# Altium schematic sheet TEC_CTRL.SchDoc
size OrCAD B; SheetNumber: 5; SheetTotal: 11
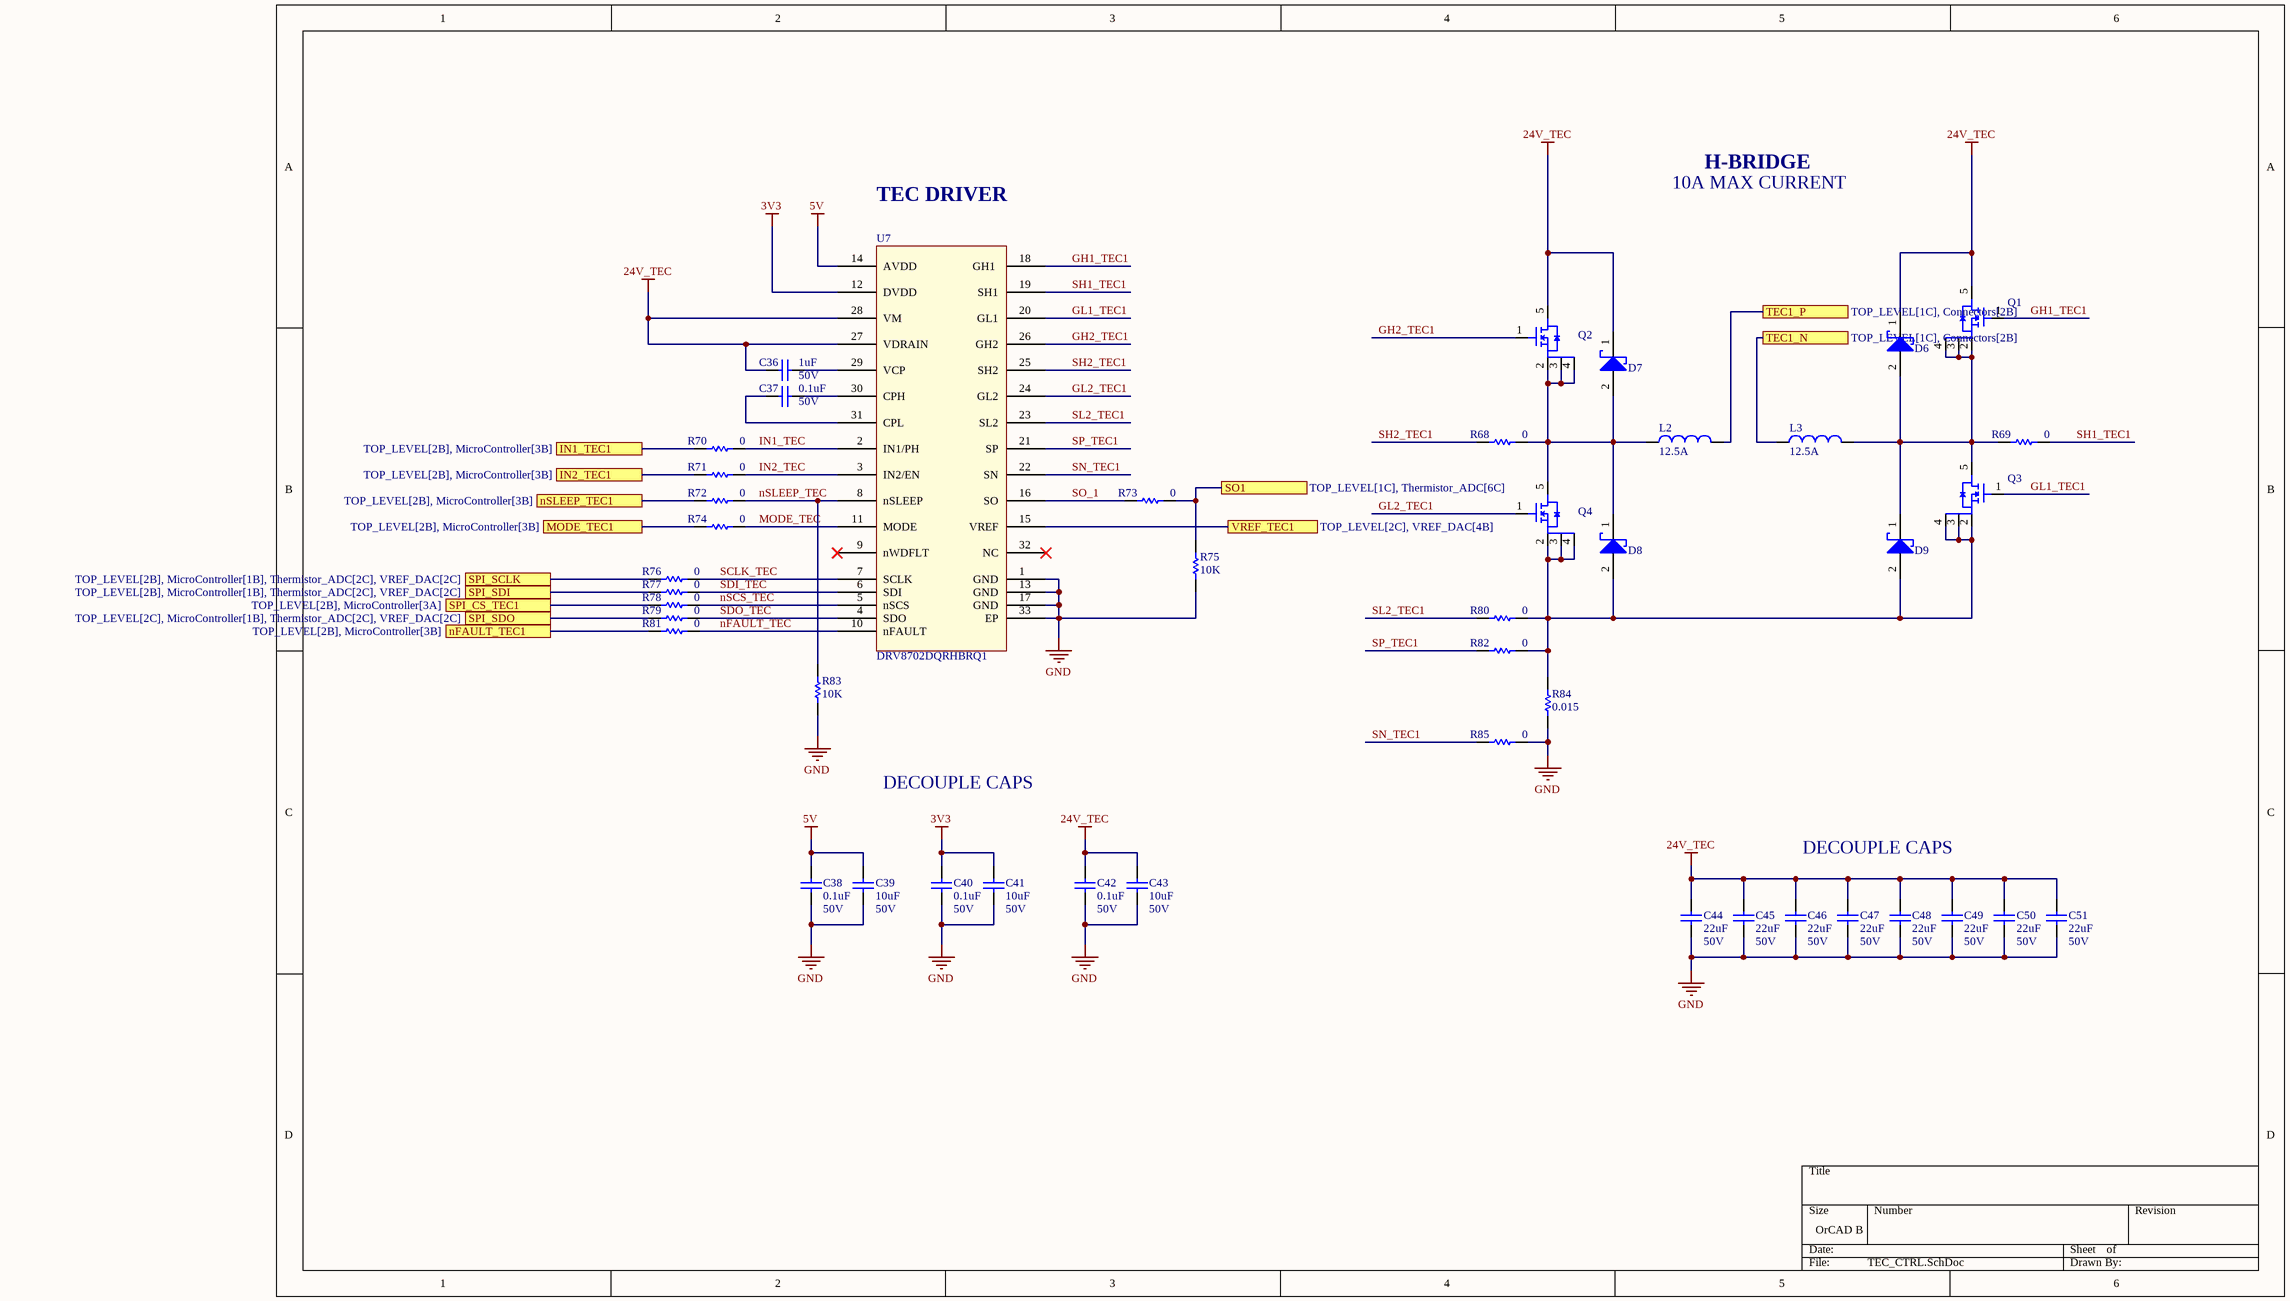
[diagram p0: TEC_CTRL.SchDoc]

## Parts
C36  value 1uF  Rating: 50V  [DEFAULT_CAPACITOR_0805]  (hidden comment: CL21B105KBFNNNE)
C37  value 0.1uF  Rating: 50V  [DEFAULT_CAPACITOR_0805]  (hidden comment: KGM21NR71H104KT)
C38  value 0.1uF  Rating: 50V  [DEFAULT_CAPACITOR_0805]  (hidden comment: KGM21NR71H104KT)
C39  value 10uF  Rating: 50V  [DEFAULT_CAPACITOR_0805]  (hidden comment: GRM21BR61H106KE43L)
C40  value 0.1uF  Rating: 50V  [DEFAULT_CAPACITOR_0805]  (hidden comment: KGM21NR71H104KT)
C41  value 10uF  Rating: 50V  [DEFAULT_CAPACITOR_0805]  (hidden comment: GRM21BR61H106KE43L)
C42  value 0.1uF  Rating: 50V  [DEFAULT_CAPACITOR_0805]  (hidden comment: KGM21NR71H104KT)
C43  value 10uF  Rating: 50V  [DEFAULT_CAPACITOR_0805]  (hidden comment: GRM21BR61H106KE43L)
C44  value 22uF  Rating: 50V  [DEFAULT_CAPACITOR_2220]  (hidden comment: C5750X7R1H226M250KB)
C45  value 22uF  Rating: 50V  [DEFAULT_CAPACITOR_2220]  (hidden comment: C5750X7R1H226M250KB)
C46  value 22uF  Rating: 50V  [DEFAULT_CAPACITOR_2220]  (hidden comment: C5750X7R1H226M250KB)
C47  value 22uF  Rating: 50V  [DEFAULT_CAPACITOR_2220]  (hidden comment: C5750X7R1H226M250KB)
C48  value 22uF  Rating: 50V  [DEFAULT_CAPACITOR_2220]  (hidden comment: C5750X7R1H226M250KB)
C49  value 22uF  Rating: 50V  [DEFAULT_CAPACITOR_2220]  (hidden comment: C5750X7R1H226M250KB)
C50  value 22uF  Rating: 50V  [DEFAULT_CAPACITOR_2220]  (hidden comment: C5750X7R1H226M250KB)
C51  value 22uF  Rating: 50V  [DEFAULT_CAPACITOR_2220]  (hidden comment: C5750X7R1H226M250KB)
D6  B2100Q-13-F  [B2100Q-13-F-SMB]  (value not drawn)
D7  B2100Q-13-F  [B2100Q-13-F-SMB]  (value not drawn)
D8  B2100Q-13-F  [B2100Q-13-F-SMB]  (value not drawn)
D9  B2100Q-13-F  [B2100Q-13-F-SMB]  (value not drawn)
L2  Rating: 12.5A  [BOURNS-SRP1770TA]  (hidden comment: SRP1770TA-150M)
L3  Rating: 12.5A  [BOURNS-SRP1770TA]  (hidden comment: SRP1770TA-150M)
Q1  BUK7S2R0-40HJ  [BUK7S2R0-40HJ-SOT1235]  (value not drawn)
Q2  BUK7S2R0-40HJ  [BUK7S2R0-40HJ-SOT1235]  (value not drawn)
Q3  BUK7S2R0-40HJ  [BUK7S2R0-40HJ-SOT1235]  (value not drawn)
Q4  BUK7S2R0-40HJ  [BUK7S2R0-40HJ-SOT1235]  (value not drawn)
R68  value 0  [DEFAULT_RESISTOR_0805]  (hidden comment: RC0805JR-070RL)
R69  value 0  [DEFAULT_RESISTOR_0805]  (hidden comment: RC0805JR-070RL)
R70  value 0  [DEFAULT_RESISTOR_0805]  (hidden comment: RC0805JR-070RL)
R71  value 0  [DEFAULT_RESISTOR_0805]  (hidden comment: RC0805JR-070RL)
R72  value 0  [DEFAULT_RESISTOR_0805]  (hidden comment: RC0805JR-070RL)
R73  value 0  [DEFAULT_RESISTOR_0805]  (hidden comment: RC0805JR-070RL)
R74  value 0  [DEFAULT_RESISTOR_0805]  (hidden comment: RC0805JR-070RL)
R75  value 10K  [DEFAULT_RESISTOR_0805]  (hidden comment: CRCW080510K0FKEA)
R76  value 0  [DEFAULT_RESISTOR_0805]  (hidden comment: RC0805JR-070RL)
R77  value 0  [DEFAULT_RESISTOR_0805]  (hidden comment: RC0805JR-070RL)
R78  value 0  [DEFAULT_RESISTOR_0805]  (hidden comment: RC0805JR-070RL)
R79  value 0  [DEFAULT_RESISTOR_0805]  (hidden comment: RC0805JR-070RL)
R80  value 0  [DEFAULT_RESISTOR_0805]  (hidden comment: RC0805JR-070RL)
R81  value 0  [DEFAULT_RESISTOR_0805]  (hidden comment: RC0805JR-070RL)
R82  value 0  [DEFAULT_RESISTOR_0805]  (hidden comment: RC0805JR-070RL)
R83  value 10K  [DEFAULT_RESISTOR_0805]  (hidden comment: CRCW080510K0FKEA)
R84  value 0.015  [DEFAULT_RESISTOR_2512]  (hidden comment: CRA2512-FZ-R015ELF)
R85  value 0  [DEFAULT_RESISTOR_0805]  (hidden comment: RC0805JR-070RL)
U7  DRV8702DQRHBRQ1  [DRV8702DQRHBRQ1-32VQFN]

## Ports
IN1_TEC1 (see TOP_LEVEL[2B], MicroController[3B]), IN2_TEC1 (see TOP_LEVEL[2B], MicroController[3B]), MODE_TEC1 (see TOP_LEVEL[2B], MicroController[3B]), nFAULT_TEC1 (see TOP_LEVEL[2B], MicroController[3B]), nSLEEP_TEC1 (see TOP_LEVEL[2B], MicroController[3B]), SO1 (see TOP_LEVEL[1C], Thermistor_ADC[6C]), SPI_CS_TEC1 (see TOP_LEVEL[2B], MicroController[3A]), SPI_SCLK (see TOP_LEVEL[2B], MicroController[1B], Thermistor_ADC[2C], VREF_DAC[2C]), SPI_SDI (see TOP_LEVEL[2B], MicroController[1B], Thermistor_ADC[2C], VREF_DAC[2C]), SPI_SDO (see TOP_LEVEL[2C], MicroController[1B], Thermistor_ADC[2C], VREF_DAC[2C]), TEC1_N (see TOP_LEVEL[1C], Connectors[2B]), TEC1_P (see TOP_LEVEL[1C], Connectors[2B]), VREF_TEC1 (see TOP_LEVEL[2C], VREF_DAC[4B])

## Nets
3V3: C40.2 C41.2 U7.12(DVDD)
5V: C38.2 C39.2 U7.14(AVDD)
24V_TEC: C36.2 C42.2 C43.2 C44.2 C45.2 C46.2 C47.2 C48.2 C49.2 C50.2 C51.2 D6.1(K) D7.1(K) Q1.5(D) Q2.5(D) U7.27(VDRAIN) U7.28(VM)
GND: C38.1 C39.1 C40.1 C41.1 C42.1 C43.1 C44.1 C45.1 C46.1 C47.1 C48.1 C49.1 C50.1 C51.1 R75.2 R83.2 R84.2 R85.1 U7.1(GND) U7.13(GND) U7.17(GND) U7.33(EP)
GH1_TEC1: Q1.1(G) U7.18(GH1)
GH2_TEC1: Q2.1(G) U7.26(GH2)
GL1_TEC1: Q3.1(G) U7.20(GL1)
GL2_TEC1: Q4.1(G) U7.24(GL2)
IN1_TEC: R70.1 U7.2(IN1/PH)
IN1_TEC1: R70.2 ; port IN1_TEC1
IN2_TEC: R71.1 U7.3(IN2/EN)
IN2_TEC1: R71.2 ; port IN2_TEC1
MODE_TEC: R74.1 U7.11(MODE)
MODE_TEC1: R74.2 ; port MODE_TEC1
nFAULT_TEC: R81.1 U7.10(nFAULT)
nFAULT_TEC1: R81.2 ; port nFAULT_TEC1
nSCS_TEC: R78.1 U7.5(nSCS)
nSLEEP_TEC: R72.1 R83.1 U7.8(nSLEEP)
nSLEEP_TEC1: R72.2 ; port nSLEEP_TEC1
SCLK_TEC: R76.1 U7.7(SCLK)
SDI_TEC: R77.1 U7.6(SDI)
SDO_TEC: R79.1 U7.4(SDO)
SH1_TEC1: R69.1 U7.19(SH1)
SH2_TEC1: R68.2 U7.25(SH2)
SL2_TEC1: R80.2 U7.23(SL2)
SN_TEC1: R85.2 U7.22(SN)
SO1: R73.1 R75.1 ; port SO1
SO_1: R73.2 U7.16(SO)
SP_TEC1: R82.2 U7.21(SP)
SPI_CS_TEC1: R78.2 ; port SPI_CS_TEC1
SPI_SCLK: R76.2 ; port SPI_SCLK
SPI_SDI: R77.2 ; port SPI_SDI
SPI_SDO: R79.2 ; port SPI_SDO
TEC1_N: L3.1 ; port TEC1_N
TEC1_P: L2.2 ; port TEC1_P
VREF_TEC1: U7.15(VREF) ; port VREF_TEC1
NetC36_1: C36.1 U7.29(VCP)
NetC37_1: C37.1 U7.30(CPH)
NetC37_2: C37.2 U7.31(CPL)
NetD6_2: D6.2(A) D9.1(K) L3.2 Q1.2(D) Q1.3(S) Q1.4(D) Q3.5(D) R69.2
NetD7_2: D7.2(A) D8.1(K) L2.1 Q2.2(D) Q2.3(S) Q2.4(D) Q4.5(D) R68.1
NetD8_2: D8.2(A) D9.2(A) Q3.2(D) Q3.3(S) Q3.4(D) Q4.2(D) Q4.3(S) Q4.4(D) R80.1 R82.1 R84.1

Not connected (* = marked no-connect by the designer): U7 9(nWDFLT)* 32(NC)*

## Notes on the sheet
- TEC DRIVER
- 10A MAX CURRENT
- H-BRIDGE
- DECOUPLE CAPS

## Library data of the parts
C36 = CL21B105KBFNNNE: CAP CER 1UF 50V X7R 0805; MFR PN: CL21B105KBFNNNE
C37 C38 C40 C42 = KGM21NR71H104KT: CAP CER 0.1UF 50V X7R 0805; Manufacturer: Cal-Chip Electronics, Inc.; Manufacturer P/N: GMC55X7R226M50NT; MFR PN: KGM21NR71H104KT
C39 C41 C43 = GRM21BR61H106KE43L: CAP CER 10UF 50V X5R 0805; MFR PN: GRM21BR61H106KE43L
C44-C51 = C5750X7R1H226M250KB: CAP CER 22UF 50V X7R 2220; MFR PN: C5750X7R1H226M250KB
D6-D9 = B2100Q-13-F: DIODE SCHOTTKY 100V 2A SMB; Manufacturer: Diodes Incorporated; Manufacturer P/N: B2100Q-13-F; MFR PN: B2100Q-13-F
L2 L3 = SRP1770TA-150M: FIXED IND 15UH 12.5A 20.5MOHM SM; Manufacturer: Bourns Inc.; Value: 15uH; Manufacturer P/N: SRP1770TA-150M; MFR PN: SRP1770TA-150M
Q1-Q4 = BUK7S2R0-40HJ: N-Channel 40 V 190A (Tc) 183W (Tc) Surface Mount LFPAK88 (SOT1235); Manufacturer: Nexperia USA Inc.; MFR PN: BUK7S2R0-40HJ
R68-R74 R76-R82 R85 = RC0805JR-070RL: RES 0 OHM JUMPER 1/8W 0805; Power: 1/8W; MFR PN: RC0805JR-070RL; Tolerance: *
R75 R83 = CRCW080510K0FKEA: RES SMD 10K OHM 1% 1/4W 0805; Power: 1/4W; MFR PN: CRCW080510K0FKEA; Tolerance: 1%
R84 = CRA2512-FZ-R015ELF: RES 0.015 OHM 1% 3W 2512; Power: 3W; MFR PN: CRA2512-FZ-R015ELF; Tolerance: 1%
U7 = DRV8702DQRHBRQ1: IC MOTOR DRIVER 5.5V-45V 32VQFN; Manufacturer: Texas Instruments; MFR PN: DRV8702DQRHBRQ1; Manufacturer P/N: DRV8702DQRHBRQ1